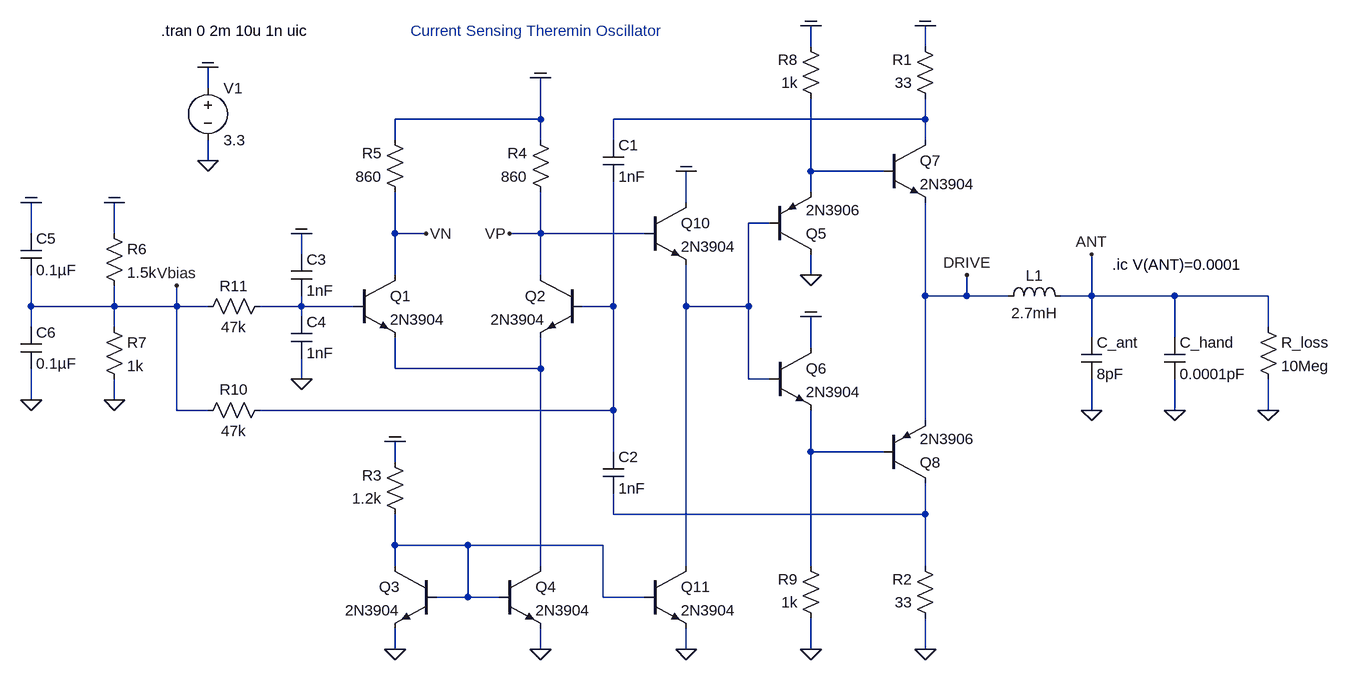
[diagram p0: schematic 2023_03_wallin_oscillator_bjt_power_rails_diff_amp_v01.asc]
2023_03_wallin_oscillator_bjt_power_rails_diff_amp_v01.asc, the LTspice schematic file:
Version 4
SHEET 1 16292 13396
WIRE 7232 7744 7232 7712
WIRE 7408 7744 7408 7712
WIRE 6304 7808 6304 7776
WIRE 6816 7856 6816 7792
WIRE 6816 7856 6592 7856
WIRE 7408 7856 7408 7824
WIRE 7408 7856 6928 7856
WIRE 6592 7888 6592 7856
WIRE 6816 7888 6816 7856
WIRE 6928 7888 6928 7856
WIRE 7408 7888 7408 7856
WIRE 6304 7920 6304 7888
WIRE 7232 7936 7232 7824
WIRE 7344 7936 7232 7936
WIRE 7232 7968 7232 7936
WIRE 7040 7984 7040 7936
WIRE 7168 8016 7136 8016
WIRE 6032 8032 6032 7984
WIRE 6160 8032 6160 7984
WIRE 6592 8032 6592 7968
WIRE 6640 8032 6592 8032
WIRE 6816 8032 6816 7968
WIRE 6816 8032 6768 8032
WIRE 6976 8032 6816 8032
WIRE 6448 8064 6448 8032
WIRE 6592 8096 6592 8032
WIRE 6816 8096 6816 8032
WIRE 7232 8096 7232 8064
WIRE 7408 8128 7408 7984
WIRE 7472 8128 7472 8096
WIRE 7472 8128 7408 8128
WIRE 7536 8128 7472 8128
WIRE 7664 8128 7664 8064
WIRE 7664 8128 7616 8128
WIRE 7792 8128 7664 8128
WIRE 7936 8128 7792 8128
WIRE 6032 8144 6032 8096
WIRE 6160 8144 6160 8112
WIRE 6160 8144 6032 8144
WIRE 6256 8144 6256 8112
WIRE 6256 8144 6160 8144
WIRE 6304 8144 6256 8144
WIRE 6448 8144 6448 8128
WIRE 6448 8144 6384 8144
WIRE 6528 8144 6448 8144
WIRE 6928 8144 6928 7952
WIRE 6928 8144 6880 8144
WIRE 7040 8144 7040 8080
WIRE 7136 8144 7136 8016
WIRE 7136 8144 7040 8144
WIRE 6448 8160 6448 8144
WIRE 6032 8176 6032 8144
WIRE 6160 8176 6160 8144
WIRE 7936 8176 7936 8128
WIRE 7664 8192 7664 8128
WIRE 7792 8192 7792 8128
WIRE 7232 8208 7232 8160
WIRE 6592 8240 6592 8192
WIRE 6816 8240 6816 8192
WIRE 6816 8240 6592 8240
WIRE 6448 8256 6448 8224
WIRE 7136 8256 7136 8144
WIRE 7168 8256 7136 8256
WIRE 6032 8288 6032 8240
WIRE 6160 8288 6160 8256
WIRE 6256 8304 6256 8144
WIRE 6304 8304 6256 8304
WIRE 6928 8304 6928 8144
WIRE 6928 8304 6384 8304
WIRE 7664 8304 7664 8256
WIRE 7792 8304 7792 8256
WIRE 7936 8304 7936 8256
WIRE 7408 8320 7408 8128
WIRE 6928 8368 6928 8304
WIRE 7232 8368 7232 8304
WIRE 7344 8368 7232 8368
WIRE 6592 8384 6592 8352
WIRE 6928 8464 6928 8432
WIRE 7408 8464 7408 8416
WIRE 7408 8464 6928 8464
WIRE 6592 8512 6592 8464
WIRE 6704 8512 6592 8512
WIRE 6912 8512 6704 8512
WIRE 6592 8544 6592 8512
WIRE 6816 8544 6816 8240
WIRE 7040 8544 7040 8144
WIRE 7232 8544 7232 8368
WIRE 7408 8544 7408 8464
WIRE 6704 8592 6704 8512
WIRE 6704 8592 6656 8592
WIRE 6752 8592 6704 8592
WIRE 6912 8592 6912 8512
WIRE 6976 8592 6912 8592
WIRE 6592 8672 6592 8640
WIRE 6816 8672 6816 8640
WIRE 7040 8672 7040 8640
WIRE 7232 8672 7232 8624
WIRE 7408 8672 7408 8624
FLAG 6304 7920 0
FLAG 6304 7776 COM
FLAG 6816 8672 0
FLAG 6592 8672 0
FLAG 6592 8352 COM
FLAG 6448 8032 COM
FLAG 6448 8256 0
FLAG 6160 8288 0
FLAG 6160 7984 COM
FLAG 6032 8288 0
FLAG 6032 7984 COM
FLAG 6816 7792 COM
FLAG 7664 8304 0
FLAG 7664 8064 ANT
FLAG 7792 8304 0
FLAG 7936 8304 0
FLAG 7408 7712 COM
FLAG 7408 8672 0
FLAG 7232 8096 0
FLAG 7232 8160 COM
FLAG 6256 8112 Vbias
FLAG 7232 8672 0
FLAG 7232 7712 COM
FLAG 6768 8032 VP
FLAG 6640 8032 VN
FLAG 7472 8096 DRIVE
FLAG 7040 7936 COM
FLAG 7040 8672 0
SYMBOL voltage 6304 7792 R0
WINDOW 123 0 0 Left 0
WINDOW 39 0 0 Left 0
SYMATTR InstName V1
SYMATTR Value 3.3
SYMBOL npn 6528 8096 R0
SYMATTR InstName Q1
SYMATTR Value 2N3904
SYMBOL res 6832 7984 R180
WINDOW 0 36 76 Left 2
WINDOW 3 36 40 Left 2
SYMATTR InstName R4
SYMATTR Value 860
SYMBOL npn 6880 8096 M0
SYMATTR InstName Q2
SYMATTR Value 2N3904
SYMBOL npn 6752 8544 R0
SYMATTR InstName Q4
SYMATTR Value 2N3904
SYMBOL npn 6656 8544 M0
SYMATTR InstName Q3
SYMATTR Value 2N3904
SYMBOL res 6608 8480 R180
WINDOW 0 36 76 Left 2
WINDOW 3 36 40 Left 2
SYMATTR InstName R3
SYMATTR Value 1.2k
SYMBOL cap 6432 8064 R0
SYMATTR InstName C3
SYMATTR Value 1nF
SYMBOL cap 6432 8160 R0
SYMATTR InstName C4
SYMATTR Value 1nF
SYMBOL res 6144 8160 R0
WINDOW 0 36 40 Left 2
WINDOW 3 36 76 Left 2
SYMATTR InstName R7
SYMATTR Value 1k
SYMBOL res 6144 8016 R0
WINDOW 0 36 40 Left 2
WINDOW 3 36 76 Left 2
SYMATTR InstName R6
SYMATTR Value 1.5k
SYMBOL res 6288 8160 R270
WINDOW 0 32 56 VTop 2
WINDOW 3 0 56 VBottom 2
SYMATTR InstName R11
SYMATTR Value 47k
SYMBOL res 6288 8320 R270
WINDOW 0 32 56 VTop 2
WINDOW 3 0 56 VBottom 2
SYMATTR InstName R10
SYMATTR Value 47k
SYMBOL cap 6016 8176 R0
SYMATTR InstName C6
SYMATTR Value 0.1µF
SYMBOL cap 6016 8032 R0
SYMATTR InstName C5
SYMATTR Value 0.1µF
SYMBOL res 6608 7984 R180
WINDOW 0 36 76 Left 2
WINDOW 3 36 40 Left 2
SYMATTR InstName R5
SYMATTR Value 860
SYMBOL cap 7648 8192 R0
SYMATTR InstName C_ant
SYMATTR Value 8pF
SYMBOL cap 7776 8192 R0
SYMATTR InstName C_hand
SYMATTR Value 0.0001pF
SYMBOL res 7920 8160 R0
WINDOW 0 36 40 Left 2
WINDOW 3 36 76 Left 2
SYMATTR InstName R_loss
SYMATTR Value 10Meg
SYMBOL ind 7520 8144 R270
WINDOW 0 32 56 VTop 2
WINDOW 3 5 56 VBottom 2
SYMATTR InstName L1
SYMATTR Value 2.7mH
SYMATTR SpiceLine Ipk=0.5 Rser=120 Cpar=1.1pF
SYMBOL npn 7168 8208 R0
SYMATTR InstName Q6
SYMATTR Value 2N3904
SYMBOL pnp 7168 8064 M180
SYMATTR InstName Q5
SYMATTR Value 2N3906
SYMBOL res 7248 8640 R180
WINDOW 0 36 76 Left 2
WINDOW 3 36 40 Left 2
SYMATTR InstName R9
SYMATTR Value 1k
SYMBOL res 7248 7840 R180
WINDOW 0 36 76 Left 2
WINDOW 3 36 40 Left 2
SYMATTR InstName R8
SYMATTR Value 1k
SYMBOL npn 7344 7888 R0
SYMATTR InstName Q7
SYMATTR Value 2N3904
SYMBOL pnp 7344 8416 M180
SYMATTR InstName Q8
SYMATTR Value 2N3906
SYMBOL res 7424 7840 R180
WINDOW 0 36 76 Left 2
WINDOW 3 36 40 Left 2
SYMATTR InstName R1
SYMATTR Value 33
SYMBOL res 7424 8640 R180
WINDOW 0 36 76 Left 2
WINDOW 3 36 40 Left 2
SYMATTR InstName R2
SYMATTR Value 33
SYMBOL cap 6912 7888 R0
SYMATTR InstName C1
SYMATTR Value 1nF
SYMBOL cap 6912 8368 R0
SYMATTR InstName C2
SYMATTR Value 1nF
SYMBOL npn 6976 7984 R0
SYMATTR InstName Q10
SYMATTR Value 2N3904
SYMBOL npn 6976 8544 R0
SYMATTR InstName Q11
SYMATTR Value 2N3904
TEXT 6232 7720 Left 2 !.tran 0 2m 10u 1n uic
TEXT 6616 7720 Left 2 ;Current Sensing Theremin Oscillator
TEXT 7696 8080 Left 2 !.ic V(ANT)=0.0001

The netlist it stands for:
* 2023_03_wallin_oscillator_bjt_power_rails_diff_amp_v01.asc
V1 COM 0 3.3
Q1 VN N004 N006 0 2N3904
R4 VP COM 860
Q2 VP N005 N006 0 2N3904
Q4 N006 N009 0 0 2N3904
Q3 N009 N009 0 0 2N3904
R3 N009 COM 1.2k
C3 COM N004 1nF
C4 N004 0 1nF
R7 Vbias 0 1k
R6 COM Vbias 1.5k
R11 Vbias N004 47k
R10 Vbias N005 47k
C6 Vbias 0 0.1µF
C5 COM Vbias 0.1µF
R5 VN COM 860
C_ant ANT 0 8pF
C_hand ANT 0 0.0001pF
R_loss ANT 0 10Meg
L1 DRIVE ANT 2.7mH Ipk=0.5 Rser=120 Cpar=1.1pF
Q6 COM N003 N007 0 2N3904
Q5 0 N003 N002 0 2N3906
R9 0 N007 1k
R8 N002 COM 1k
Q7 N001 N002 DRIVE 0 2N3904
Q8 N008 N007 DRIVE 0 2N3906
R1 N001 COM 33
R2 0 N008 33
C1 N001 N005 1nF
C2 N005 N008 1nF
Q10 COM VP N003 0 2N3904
Q11 N003 N009 0 0 2N3904
.model NPN NPN
.model PNP PNP
.lib standard.bjt
.tran 0 2m 10u 1n uic
* Current Sensing Theremin Oscillator
.ic V(ANT)=0.0001
.backanno
.end